# Altium schematic sheet pagerFUTURE.SchDoc
size A3; SheetNumber: 1; SheetTotal: 1; SPICEModelCacheGOQOUFPS: <root> / <DocumentId>GOQOUFPS</DocumentId> / <CacheFrame Number="0"> / <Model Name="tmk316bj106_l-t" Kind="CKT"> / <Text>* TMK316BJ106_L-T     SPICE MODEL  ( General Type ) / *-------------------------------------------------------------------------------------------------------- / * Model Generated by TAIYO YUDEN Corporation (http://www.ty-top.com) / * Version 1.0 / * TAIYO YUDEN Control No. 170508_120810 / *-------------------------------------------------------------------------------------------------------- / * / * Products Name : Multilayer Ceramic Capacitors / * / * Characteristics : / *     Capacitance : 10 uF , Rated Voltage : 25V , TCC : X5R / *     Case Size : 3.2 x 1.6 / 0.126 x 0.063 [mm/inch] , Thickness : 1.6 / 0.063 [mm/inch] / *     (Conditions: Temperature = 25 degC , DC Bias Current/Voltage = 0A / 0V) / * / * Frequency Range : 40Hz - 3GHz / * / * External Node Assignments : / * / *  1  o---| |---o  2 / * / *-------------------------------------------------------------------------------------------------------- / .SubCkt TMK316BJ106_L-T 1 2 / **************************** / C0 1 110 9.0657u / Cm 1 101 0.42176u / C1 101 102 0.58105u / Rc1 101 102 903.1 / C2 102 103 0.31388u / Rc2 102 103 191.82 / C3 103 110 2644.6p / Rc3 103 110 18.453 / C2m 1 301 0.98871u / C21 301 302 2.9461u / Rc21 301 302 1.8689k / C22 302 303 1.1307u / Rc22 302 303 4.2347k / C23 303 304 2.4452u / Rc23 303 304 695.61 / C24 304 305 1.0989u / Rc24 304 305 201.73 / C25 305 306 0.45622u / Rc25 305 306 224 / C26 306 307 0.30805u / Rc26 306 307 37.75 / C27 307 308 0.042132u / Rc27 307 308 28.109 / C28 308 309 0.02251u / Rc28 308 309 21.638 / C29 309 110 457.07p / Rc29 309 110 52.478 / Rp0 1 110 10Meg / L0 110 120 0.40424n / Lm 120 130 0.37328n / L1 120 121 0.68558n / RL1 121 130 0.31645 / L2 120 122 0.74722n / RL2 122 130 0.12229 / L3 120 123 119.58n / RL3 123 130 1.9187k / CR 120 124 0.57074u / LR 124 125 1.669n / RR 125 130 41.045m / CL 130 140 18.167p / LL 130 140 0.15493n / RL 130 140 3.8578 / Rs 140 2 3.99m / **************************** / .ends</Text> / </Model> / </CacheFrame> / </root>
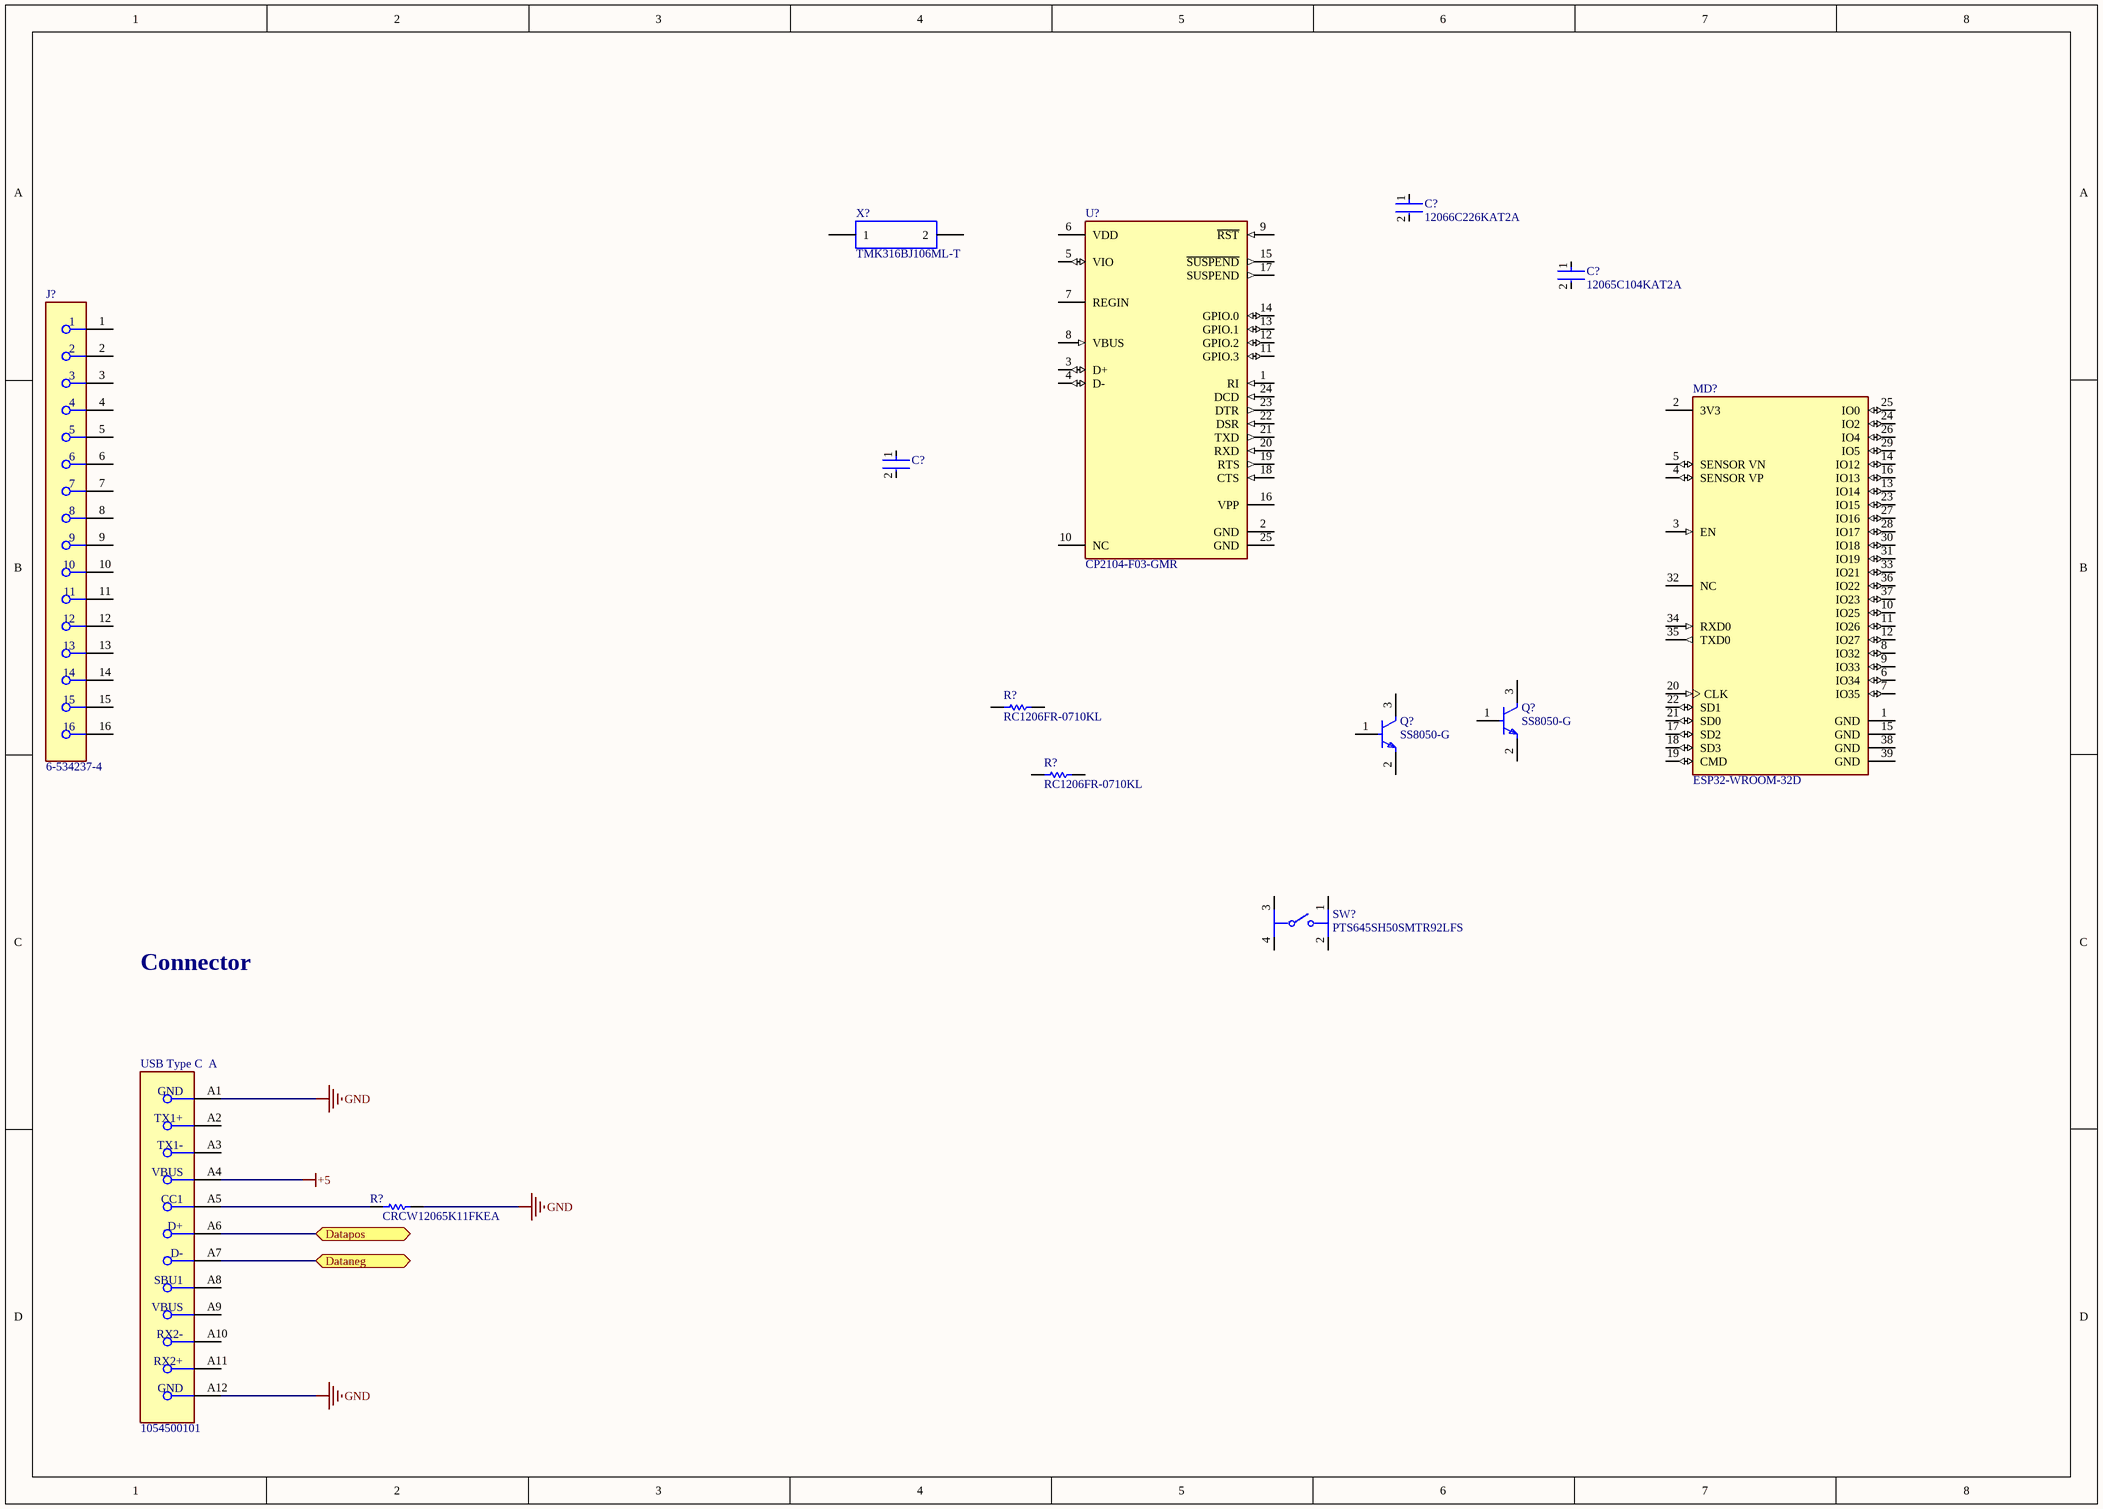
[diagram p0: pagerFUTURE.SchDoc]

## Parts
(Parts that share a designator on the sheet are numbered #1, #2 ... from top to bottom, then left to right.)
C?#1  12066C226KAT2A  [FP-1206-L_3_2_0_2-W_1_6_0-IPC_A]
C?#2  12065C104KAT2A  [FP-1206-L_3_2_0_2-W_1_6_0-MFG]
C?#3  GRM31CR71H475KA12L  [FP-GRM31C-0_2-e0_3_0_8-IPC_C]  (value not drawn)
J?  6-534237-4  [FP-6-534237-4-MFG]
MD?  ESP32-WROOM-32D  [FP-ESP32-WROOM-32D-MFG]
Q?#1  SS8050-G  [FP-SS8050-G-MFG]
Q?#2  SS8050-G  [FP-SS8050-G-MFG]
R?#1  RC1206FR-0710KL  [RESC3116X65X40ML10T20]
R?#2  RC1206FR-0710KL  [RESC3116X65X40ML10T20]
R?#3  CRCW12065K11FKEA  [RESC3216X60X45ML10T20]
SW?  PTS645SH50SMTR92LFS  [FP-PTS645SH50SMTR92LFS-MFG]
U?  CP2104-F03-GMR  [FP-CP2104-F03-GMR-MFG]
USB_Type_C  1054500101  [FP-1054500101-MFG]  (part A of 3)
X?  TMK316BJ106ML-T

## Ports
Dataneg (bidir), Datapos (bidir)

## Nets
+5: USB_Type_C.A4(VBUS)
GND: R?#3.2 USB_Type_C.A1(GND) USB_Type_C.A12(GND)
Dataneg: USB_Type_C.A7(D-) ; port Dataneg
Datapos: USB_Type_C.A6(D+) ; port Datapos
NetR?#3_1: R?#3.1 USB_Type_C.A5(CC1)

Not connected (* = marked no-connect by the designer): C?#1 1 2; C?#2 1 2; C?#3 1 2; J? 1 2 3 4 5 6 7 8 9 10 11 12 13 14 15 16; MD? 1(GND) 2(3V3) 3(EN) 4(SENSOR_VP) 5(SENSOR_VN) 6(IO34) 7(IO35) 8(IO32) 9(IO33) 10(IO25) 11(IO26) 12(IO27) 13(IO14) 14(IO12) 15(GND) 16(IO13) 17(SD2) 18(SD3) 19(CMD) 20(CLK) 21(SD0) 22(SD1) 23(IO15) 24(IO2) 25(IO0) 26(IO4) 27(IO16) 28(IO17) 29(IO5) 30(IO18) 31(IO19) 32(NC) 33(IO21) 34(RXD0) 35(TXD0) 36(IO22) 37(IO23) 38(GND) 39(GND); Q?#1 1(B) 2(E) 3(C); Q?#2 1(B) 2(E) 3(C); R?#1 1 2; R?#2 1 2; SW? 1 2 3 4; U? 1(RI) 2(GND) 3(D+) 4(D-) 5(VIO) 6(VDD) 7(REGIN) 8(VBUS) 9(~{RST}) 10(NC) 11(GPIO.3) 12(GPIO.2) 13(GPIO.1) 14(GPIO.0) 15(~{SUSPEND}) 16(VPP) 17(SUSPEND) 18(CTS) 19(RTS) 20(RXD) 21(TXD) 22(DSR) 23(DTR) 24(DCD) 25(GND); USB_Type_C A2(TX1+) A3(TX1-) A8(SBU1) A9(VBUS) A10(RX2-) A11(RX2+); X? 1 2

## Notes on the sheet
- Connector

## Library data of the parts
C?#1 = CMP-1037-04985-3: CAP CER 22UF 6.3V X7R 1206; Tolerance: 10%; Dissipation Factor: 5%; Thickness: 0.07inch; Min Operating Temperature: -55°C; Width: 1.6mm; Case Code (Metric): 3216; Construction: Flat; Max Operating Temperature: 125°C; Case/Package: 1206; Case Code (Imperial): 1206; Lead Free: Lead Free; Capacitance: 22uF; REACH SVHC: No SVHC; Voltage Rating (DC): 6.3V; Number of Pins: 2; Contact Plating: Tin; Dielectric: X7R; Radiation Hardening: No; Depth: 1.6mm; Series: FlEXITERM; Mount: Surface Mount; Voltage Rating: 6.3V; Package Quantity: 2500; RoHS Compliant: Yes; Length: 3.2mm; Height: 1.78mm; Voltage: 6.3V; Termination: SMD/SMT; Packaging: Tape and Reel
C?#2 = CMP-2000-05018-2: General Purpose Ceramic Capacitor, 1206, 100nF, 10%, X7R, 15%, 50V; Dissipation Factor: 2.5%; Insulation Resistance: 100GR; Dielectric: X7R; Thickness: 0.037inch; Case Code (Imperial): 1206; Case Code (Metric): 3216; Dielectric Material: Ceramic; Width: 1.6mm; Voltage Rating (DC): 50V; Termination: SMD/SMT; Tolerance: 10%; REACH SVHC: No SVHC; Height: 0.94mm; Length: 3.2mm; Voltage: 50V; Capacitance: 100nF; Packaging: Tape and Reel; Depth: 1.6mm; Voltage Rating: 50V; Series: -; Contact Plating: Tin; Mount: Surface Mount; Package Quantity: 1; Construction: Flat; Max Operating Temperature: 125°C; Min Operating Temperature: -55°C; Case/Package: 1206; Lead Free: Lead Free; RoHS Compliant: Yes; Number of Pins: 2; Radiation Hardening: No
C?#3 = CMP-1037-04923-3: Chip Multilayer Ceramic Capacitors for General Purpose, 1206, 4.7uF, X7R, 15%, 10%, 50V; Height: 1.6mm; Voltage: 50V; Capacitance: 4.7uF; Lead Free: Lead Free; Max Operating Temperature: 125°C; Packaging: Tape and Reel; REACH SVHC: No SVHC; Voltage Rating: 50V; Mount: Surface Mount; Termination: SMD/SMT; Tolerance: 10%; Case/Package: 1206; Material: Ceramic; Depth: 1.6mm; Length: 3.2mm; Case Code (Metric): 3216; Voltage Rating (DC): 50V; Case Code (Imperial): 1206; Radiation Hardening: No; Width: 0.063inch; Thickness: 0.071inch; Package Quantity: 2000; Min Operating Temperature: -55°C; Dielectric: X7R
J? = CMP-03364-000014-1: CONN RCPT 16POS 0.1 GOLD PCB; Boss: No (Without); Approvals: CSA; Connector Type: Receptacle; Number of Positions: 16; Contact Post Length: 2.92mm; PCB Mounting Orientation: Vertical; Stackable: Yes; Row Spacing: 0.1inch; Current Rating: 2A; PCB Mount Retention: Without; Pitch: 2.54mm; PCB Thickness: 2.4mm; Contact Resistance: 12MR; Voltage Rating: 750V; High Temperature Compatible: No; Insulation Resistance: 5GR; ELV: Compliant; Insulation Color: Black; Min Operating Temperature: -65°C; Fastening Type: Pull; Orientation: Straight; RoHS Compliant: Yes; Contact Shape: Square; Series: AMPMODU MOD IV; Length: 40.64mm; Packaging: Rail/Tube; Radiation Hardening: No; Tail Length: 2.92mm; Height: 3.56mm; Lead Free: Lead Free; Contact Material: Bronze; Reach SVHC Compliant: Yes; Contact Current Rating: 2A; Color: Black; Termination: Solder; Housing Material: Polyester; Number of Contacts: 16; Contact Plating: Gold; Number of Rows: 1; Package Quantity: 14; Sealable: No (Without); Max Operating Temperature: 105°C; Flammability Rating: UL94 V-0; Depth: 3.56mm; Insulation Material: Glass; Housing Color: Black; Gender: Receptacle; Mount: Through Hole; Contact Finish - Mating: GOLD; Contact Type: Female Socket
MD? = CMP-194065-000003-1: WIFI MODULE 32MBITS SPI FLASH; Manufacturer: Espressif Systems; Max Supply Voltage: 3.6V; Nominal Supply Current: 500mA; Max Frequency: 2484MHz; Number Of Adc Channels: 16; Number Of Gpio: 32; Interface: I2C,SPI,UART,Ethernet,I2S,Other; Data Rate: 150Mbits/s; Min Supply Voltage: 3V; Bandwidth: 72MHz; Sensitivity: -98dBm; Octopart: https://octopart.com/esp32-wroom-32d-espressif+systems-91040050; Package: ESP32-WROOM-32D; ComponentLink2URL: https://www.espressif.com/sites/default/files/documentation/esp32-wroom-32d_esp32-wroom-32u_datasheet_en.pdf; Lead Free: Yes; Category: UNK; Mouser Description: Wi-Fi/BT BLE Module ESP32-D0WD, SPI Flash, UART, P; Device Class L1: Integrated Circuits (ICs); RoHS: TRUE; Temperature Range Low: -40°C; ComponentLink2Description: Datasheet; Digikey Description: WIFI MODULE 32MBITS SPI FLASH; Height: 3.2mm; Temperature: -40°C to +85°C; Manufacturer Part Number: ESP32-WROOM-32D; Device Class L3: Transceivers; Device Class L2: RF Semiconductors and Devices; Temperature Range High: +85°C; Automotive: No
Q?#1 Q?#2 = CMP-20235-000001-1: NPN TRANSISTOR 1.5A 40V SOT-23 R; Transition Frequency: 100MHz; Max Breakdown Voltage: 25V; Collector Emitter Voltage (VCEO): 400mV; Max Power Dissipation: 300mW; Max Collector Current: 1.5A; Case/Package: TO-236-3; Packaging: Tape and Reel; RoHS Compliant: Yes; Mount: Surface Mount; Collector Emitter Breakdown Voltage: 25V
R?#1 R?#2 = CMP-1014-00623-2: Chip Resistor, 10 KOhm, +/- 1%, 0.25 W, -55 to 155 degC, 1206 (3216 Metric), RoHS, Tape and Reel; Manufacturer: Yageo; Voltage Rating: 200V; Resistance: 10KOhm; Temperature Coefficient: 100ppm/degreesC; Power Rating: 250mW; Packaging: TapeandReel; Termination: SMD/SMT; REACH SVHC: Unknown; Tolerance: 1%; Height: 0.55mm; Composition: ThickFilm; Max Operating Temperature: 155degC; Datasheet Version: Rev. 5, 10/2016; Lead Free: LeadFree; Case Code (Metric): 3216; Depth: 1.6mm; Package Quantity: 5000; RoHSCompliant: true; Military Standard: Not; Case/Package: 1206; Case Code (Imperial): 1206; Min Operating Temperature: -55degC; Datasheet URL: http://www.yageo.com/NewPortal/yageodocoutput?fileName=/pdf/R-Chip/PYu-RC_Group_51_RoHS_L_5.pdf; Length: 3.1mm; Manufacturer URL: http://www.yageo.com/; Package Reference: 1206.0; Width: 1.6mm; Package Description: 2-Pin Surface Mount Device, Body 3.1 x 1.6 mm
R?#3 = CMP-2003-02297-1: Manufacturer: Vishay Dale; Part Number: CRCW12065K11FKEA
SW? = CMP-10040-000028-1: SWITCH TACTILE SPST-NO 0.05A 12V; Operating Force: 200gf; Current Rating: 50mA; Illumination Type: Non-Illuminated; Actuator Material: Nylon; Throw Configuration: SPST; Switch Function: Off-Mom; Mechanical Life: 100000Cycles; Actuator Type: Standard; Packaging: Tape and Reel; Termination: Gull Wing; Max Operating Temperature: 60°C; Length: 6mm; REACH SVHC: No SVHC; Orientation: Straight; Max Voltage Rating (DC): 12V; Package Quantity: 1000; Max Current Rating: 50mA; Mount: Surface Mount; Contact Material: Bronze; Case/Package: SMD/SMT; Lead Free: Lead Free; Min Operating Temperature: -20°C; Contact Plating: Silver; Color: Black; Depth: 9mm; Voltage Rating (DC): 12V
U? = CMP-08107-000004-1: IC SGL USB-TO-UART BRIDGE 24QFN; Manufacturer: Silicon Laboratories; Max Supply Voltage: 3.6V; Min Supply Voltage: 1.8V; Nominal Supply Current: 100-17000uA; Standoff Height: 0mm; Interface: UART,USB; Temperature Range Low: -40°C; Lead Free: Yes; Device Class L3: Controllers; Ambient Temperature Range Low: -55°C; Automotive: No; Category: IC; Temperature: -40°C to +85°C; Octopart: https://octopart.com/cp2104-f03-gmr-silicon+labs-19668642; Ambient Temperature Range High: +125°C; Package: CP2104-F03-GMR; Device Class L2: Interface ICs; Digikey Description: IC SGL USB-TO-UART BRIDGE 24QFN; Device Class L1: Integrated Circuits (ICs); Manufacturer Part Number: CP2104-F03-GMR; Temperature Range High: +85°C; ComponentLink2URL: https://www.silabs.com/documents/public/data-sheets/cp2104.pdf; Height: 0.8mm; Ipc Land Pattern Name: QFN50P400X400X75-24; Mouser Description: I/O Controller Interface IC USB to UART bridge; ComponentLink2Description: Datasheet; RoHS: TRUE
USB_Type_C = CMP-04767-000004-1: CONN RCP USB3.1 TYPEC 24P SMD RA; Manufacturer: Molex; Number Of Contacts: 24; Description: USB Shielded I/O Receptacle; Type C; Right Angle; Surface Mount; Gold over Nickel; Voltage Rating: 30V; Shielding: true; Is Female: yes; Current Rating: 0.25/1.25/5A; Pitch: 0.5mm; Conn Orientation: Right Angle; Package: 0; Height: 3.44mm; Footprint Url: https://www.molex.com/pdm_docs/sd/1054500101_sd.pdf; Device Class L1: Connectors; Category: Conn; Device Class L2: USB Connectors; Digikey Description: CONN RCP USB3.1 TYPEC 24P SMD RA; Contact Material: Gold,Nickel; Mouser Description: USB Shielded I/O Receptacle; Type C; Right Angle; Surface Mount; Gold over Nickel; ComponentLink2Description: Datasheet; Lead Free: Yes; Automotive: No; Temperature Range High: +85°C; RoHS: TRUE; Octopart: https://octopart.com/105450-0101-molex-68082325; ComponentLink2URL: https://www.molex.com/webdocs/datasheets/pdf/en-us/1054500101_IO_CONNECTORS.pdf; Temperature: -30°C to +85°C; Usb Standard: USB 3.1; Temperature Range Low: -30°C; Device Class L3: unset; Manufacturer Part Number: 1054500101
X? = CMP-14477-004706-1: None; Voltage Rating: 25V; Capacitance: 10uF; Tolerance: 10%; Dielectric: X5R; Package Quantity: 1; Length: 3.2mm; Construction: Flat; Packaging: Tape and Reel; Max Operating Temperature: 85°C; Series: M; Mount: Surface Mount; RoHS Compliant: Yes; Min Operating Temperature: -55°C; Width: 1.6mm; Thickness: 0.071inch; Halogen Free: Halogen Free; Resistor Type: Ceramic; Case Code (Metric): 3216; Height: 1.6mm; Lead Free: Lead Free; Case Code (Imperial): 1206; Number of Pins: 2; Termination: SMD/SMT; Radiation Hardening: No; Contact Plating: Nickel; Voltage Rating (DC): 25V; Voltage: 25V; Depth: 1.6mm; Case/Package: 1206